# EAGLE schematic KlingelESP32V1 (EAGLE 9.6.2)
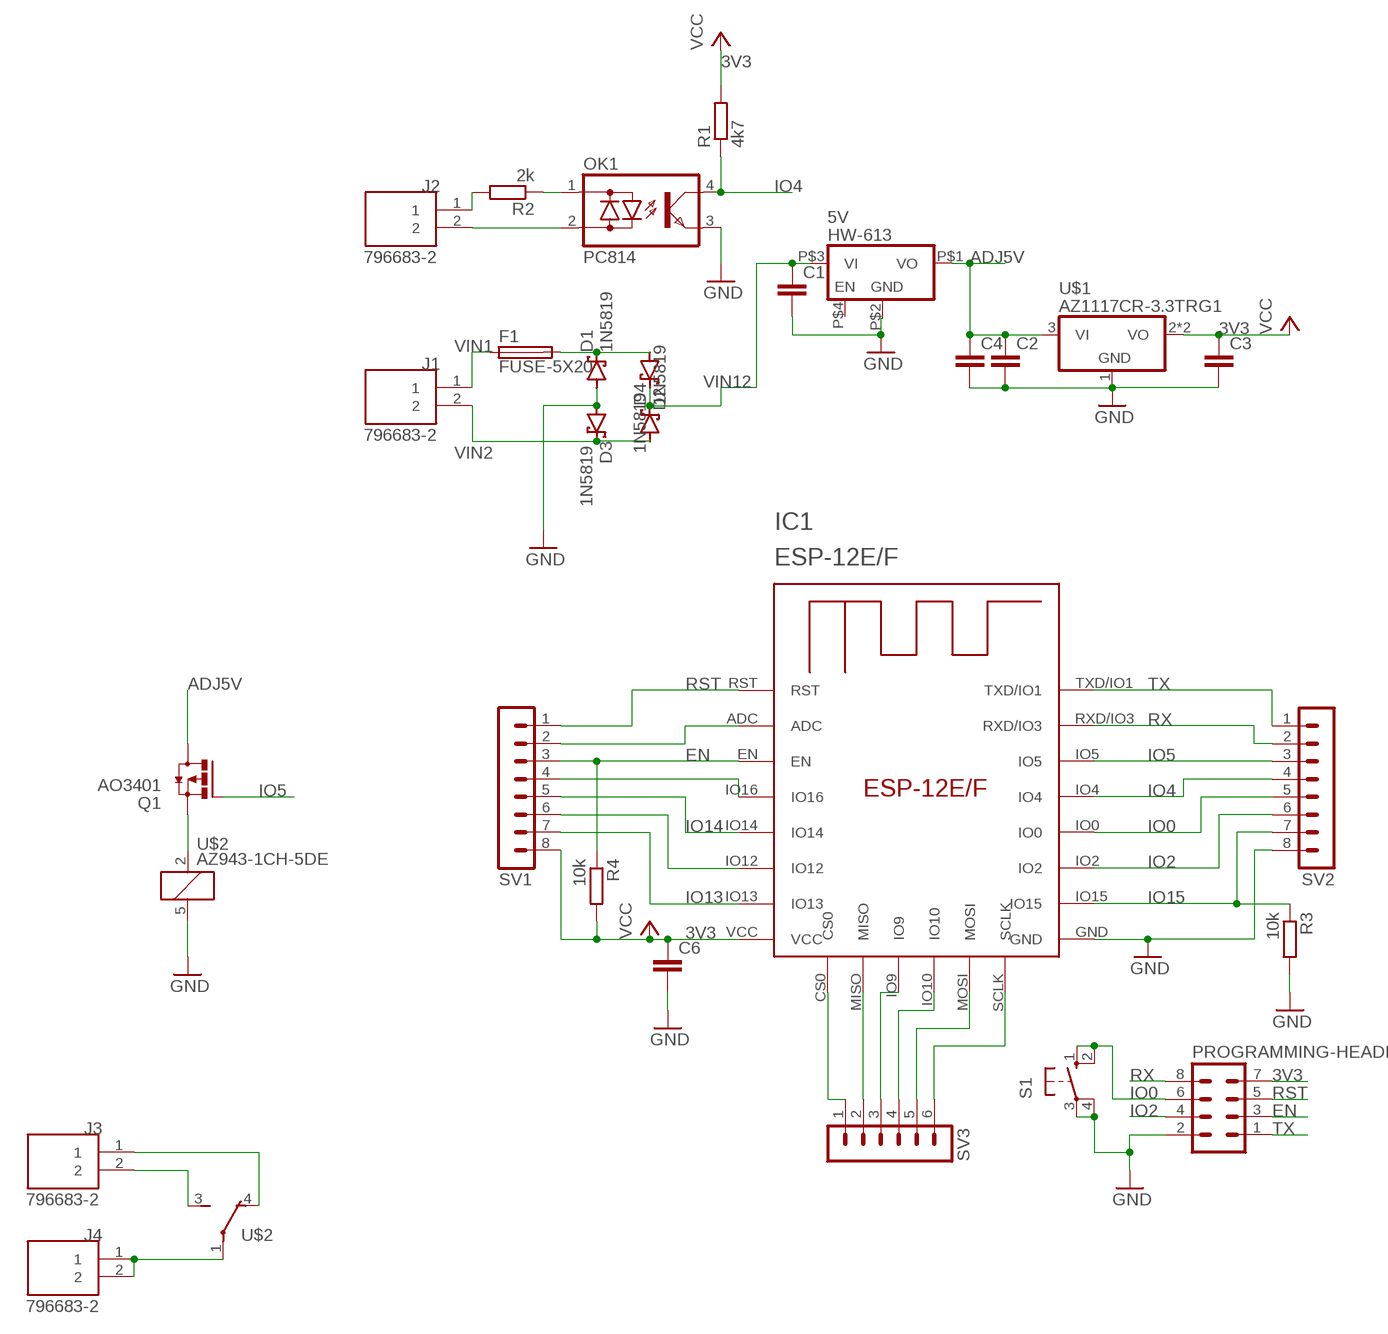
[diagram p0: schematic, sheet 1]

## Parts
5V  HW-613  [HW-613]
C1  C-EUC0805  [C0805]
C2  C-EUC0805  [C0805]
C3  C-EUC0805  [C0805]
C4  C-EUC0805  [C0805]
C6  C-EUC0805  [C0805]
D1  1N5819  1N5819-B  [DO41-7.6]
D2  1N5819  1N5819-B  [DO41-7.6]
D3  1N5819  1N5819-B  [DO41-7.6]
D4  1N5819  1N5819-B  [DO41-7.6]
F1  FUSE-5X20  [0751.0052]
IC1  ESP-12E/F  [ESP-12E]
J1  796683-2  [TE_796683-2]
J2  796683-2  [TE_796683-2]
J3  796683-2  [TE_796683-2]
J4  796683-2  [TE_796683-2]
OK1  PC814  [DIL04]
PROGRAMMING-HEADER  MA04-2  [MA04-2]
Q1  AO3401  FDN360P  [SUPER-SOT3]
R1  4k7  R-EU_R0805  [R0805]
R2  2k  R-EU_R0805  [R0805]
R3  10k  R-EU_R0805  [R0805]
R4  10k  R-EU_R0805  [R0805]
S1  10-XX  [B3F-10XX]
SV1  MA08-1  [MA08-1]
SV2  MA08-1  [MA08-1]
SV3  MA06-1  [MA06-1]
U$1  AZ1117CR-3.3TRG1  [SOT89]
U$2  AZ943-1CH-5DE  [AZ943-1CH-5DE]

## Nets
3V3: C3.1 C6.1 IC1.VCC PROGRAMMING-HEADER.7 R1.2 R4.2 SV1.8 U$1.2(VO) U$1.2@1(VO) ; supply symbol labelled VCC
ADJ5V: 5V.P$1(VO) C2.1 C4.1 Q1.3(D) U$1.3(VI)
EN: IC1.EN PROGRAMMING-HEADER.3 R4.1 SV1.3
GND: 5V.P$2(ADJ1) C1.2 C2.2 C3.2 C4.2 C6.2 D1.A D3.A IC1.GND OK1.3(E) PROGRAMMING-HEADER.2 R3.2 S1.3(P) S1.4(P1) SV2.8 U$1.1(GND) U$2.5
IO0: IC1.IO0 PROGRAMMING-HEADER.6 S1.1(S) S1.2(S1) SV2.5
IO2: IC1.IO2 PROGRAMMING-HEADER.4 SV2.6
IO4: IC1.IO4 OK1.4(C) R1.1 SV2.4
IO5: IC1.IO5 Q1.1(G) SV2.3
IO13: IC1.IO13 SV1.7
IO14: IC1.IO14 SV1.5
IO15: IC1.IO15 R3.1 SV2.7
N$1: J2.1 R2.2
N$2: IC1.CS0 SV3.1
N$3: Q1.2(S) U$2.2
N$5: D1.C D2.A F1.P$3 F1.P$4
N$6: OK1.1(AC1) R2.1
N$7: J2.2 OK1.2(AC2)
N$8: IC1.MISO SV3.2
N$9: IC1.IO9 SV3.3
N$10: IC1.IO10 SV3.4
N$11: IC1.MOSI SV3.5
N$12: IC1.SCLK SV3.6
N$14: IC1.ADC SV1.2
N$16: IC1.IO16 SV1.4
N$18: IC1.IO12 SV1.6
N$24: J3.2 U$2.3(S)
N$25: J3.1 U$2.4(O)
N$27: J4.1 J4.2 U$2.1(P)
RST: IC1.RST PROGRAMMING-HEADER.5 SV1.1
RX: IC1.RXD/IO3 PROGRAMMING-HEADER.8 SV2.2
TX: IC1.TXD/IO1 PROGRAMMING-HEADER.1 SV2.1
VIN1: F1.P$1 F1.P$2 J1.1
VIN2: D3.C D4.A J1.2
VIN12: 5V.P$3(VI) C1.1 D2.C D4.C
Unconnected: 5V.P$4(ADJ)

## Library data of the parts
5V = Lukas-Private-Library:HW-613
C1-C4 C6 = rcl:C-EU: CAPACITOR, European symbol; SPICEPREFIX: C
D1-D4 = diode:1N581*: 1.0A SCHOTTKY BARRIER RECTIFIER Source: http://www.diodes.com/datasheets/ds23001.pdf
F1 = Lukas-Private-Library:FUSE-5X20
IC1 = esp-12e-f:ESP-12E/F
J1-J4 = 796683-2:796683-2: Check availability <https://pricing.snapeda.com/parts/796683-2/TE%20Connectivity/view-part?ref=eda>; AVAILABILITY: In Stock; COMMENT: 796683-2; DESCRIPTION: Wire to Board 2 Position 5 mm Pitch 30-12 AWG Euro Style Terminal Block; MF: TE Connectivity; MP: 796683-2; PACKAGE: None; PRICE: None; PURCHASE-URL: https://pricing.snapeda.com/search/part/796683-2/?ref=eda
OK1 = optocoupler:PC814: SHARP OPTO COUPLER; OC_FARNELL: 9707662; OC_NEWARK: unknown
PROGRAMMING-HEADER = con-lstb:MA04-2: PIN HEADER; OC_FARNELL: unknown; OC_NEWARK: unknown
Q1 = transistor-power:FDN360P: Single P-Channel, PowerTrench (R) MOSFET Source: http://www.fairchildsemi.com/ds/FD/FDN360P.pdf
R1-R4 = rcl:R-EU_: RESISTOR, European symbol; SPICEPREFIX: R
S1 = switch-omron:10-XX: OMRON SWITCH; MPN: B3F-1000; OC_FARNELL: 176432; OC_NEWARK: 36M3542
SV1 SV2 = con-lstb:MA08-1: PIN HEADER; OC_FARNELL: unknown; OC_NEWARK: unknown
SV3 = con-lstb:MA06-1: PIN HEADER; OC_FARNELL: unknown; OC_NEWARK: unknown
U$1 = Lukas-Private-Library:AZ1117CR-3.3TRG1
U$2 = Lukas-Private-Library:AZ943-1CH-5DE

## Net classes
0 default: width 0.305 mm, clearance 0.152 mm